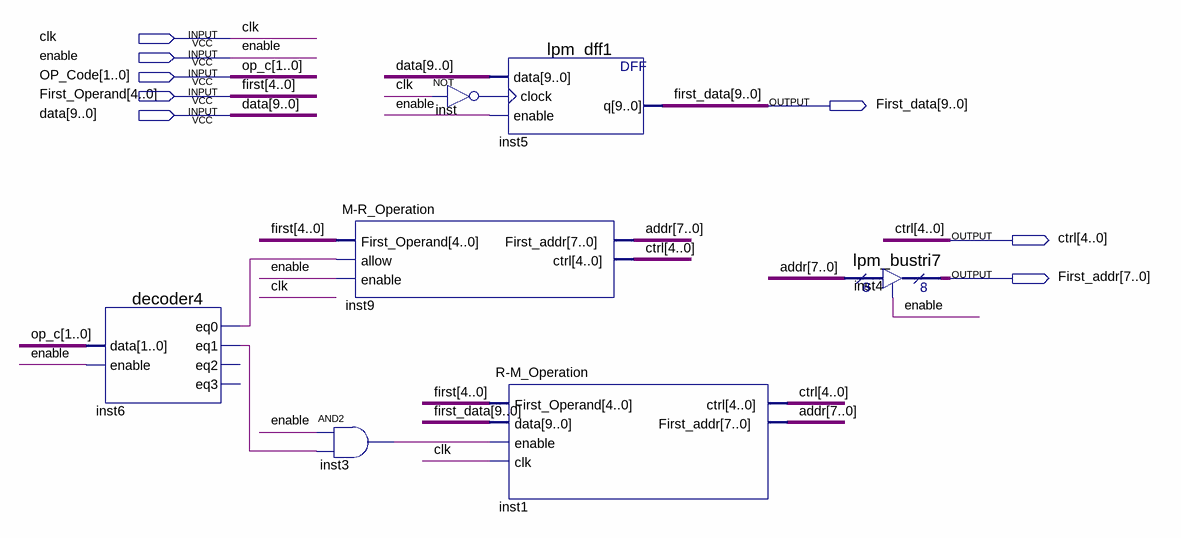
[diagram p0: schematic sheet]
// Quartus schematic OperandRetrieval.bdf as structural Verilog: 7 symbols, 8 pins
module OperandRetrieval (
  input  clk,
  input  enable,
  input  [1:0] OP_Code,
  input  [4:0] First_Operand,
  input  [9:0] data,
  output [9:0] First_data,
  output [4:0] ctrl,
  output [7:0] First_addr
);

  wire inst3_out, inst6_eq0, inst6_eq1, inst_out;
  wire [7:0] addr;

  decoder4 inst6 (.data(OP_Code), .enable(enable), .eq0(inst6_eq0), .eq1(inst6_eq1));  // open: eq2, eq3
  \M-R_Operation  inst9 (
    .First_Operand(First_Operand), .allow(inst6_eq0), .enable(enable), .First_addr(addr), .ctrl(ctrl));
  and inst3 (inst3_out, enable, inst6_eq1);
  lpm_dff1 inst5 (.data(data), .clock(inst_out), .enable(enable), .q(First_data));
  not inst (inst_out, clk);
  \R-M_Operation  inst1 (
    .First_Operand(First_Operand), .data(First_data), .enable(inst3_out), .clk(clk), .ctrl(ctrl),
    .First_addr(addr));
  lpm_bustri7 inst4 (.enabledt(enable), .data(addr), .tridata(First_addr));

  // Other names for the same wires on the sheet: first[4:0] = First_Operand; op_c[1:0] = OP_Code
endmodule
